# EAGLE schematic RoPi 2560 (EAGLE 6.5.0)
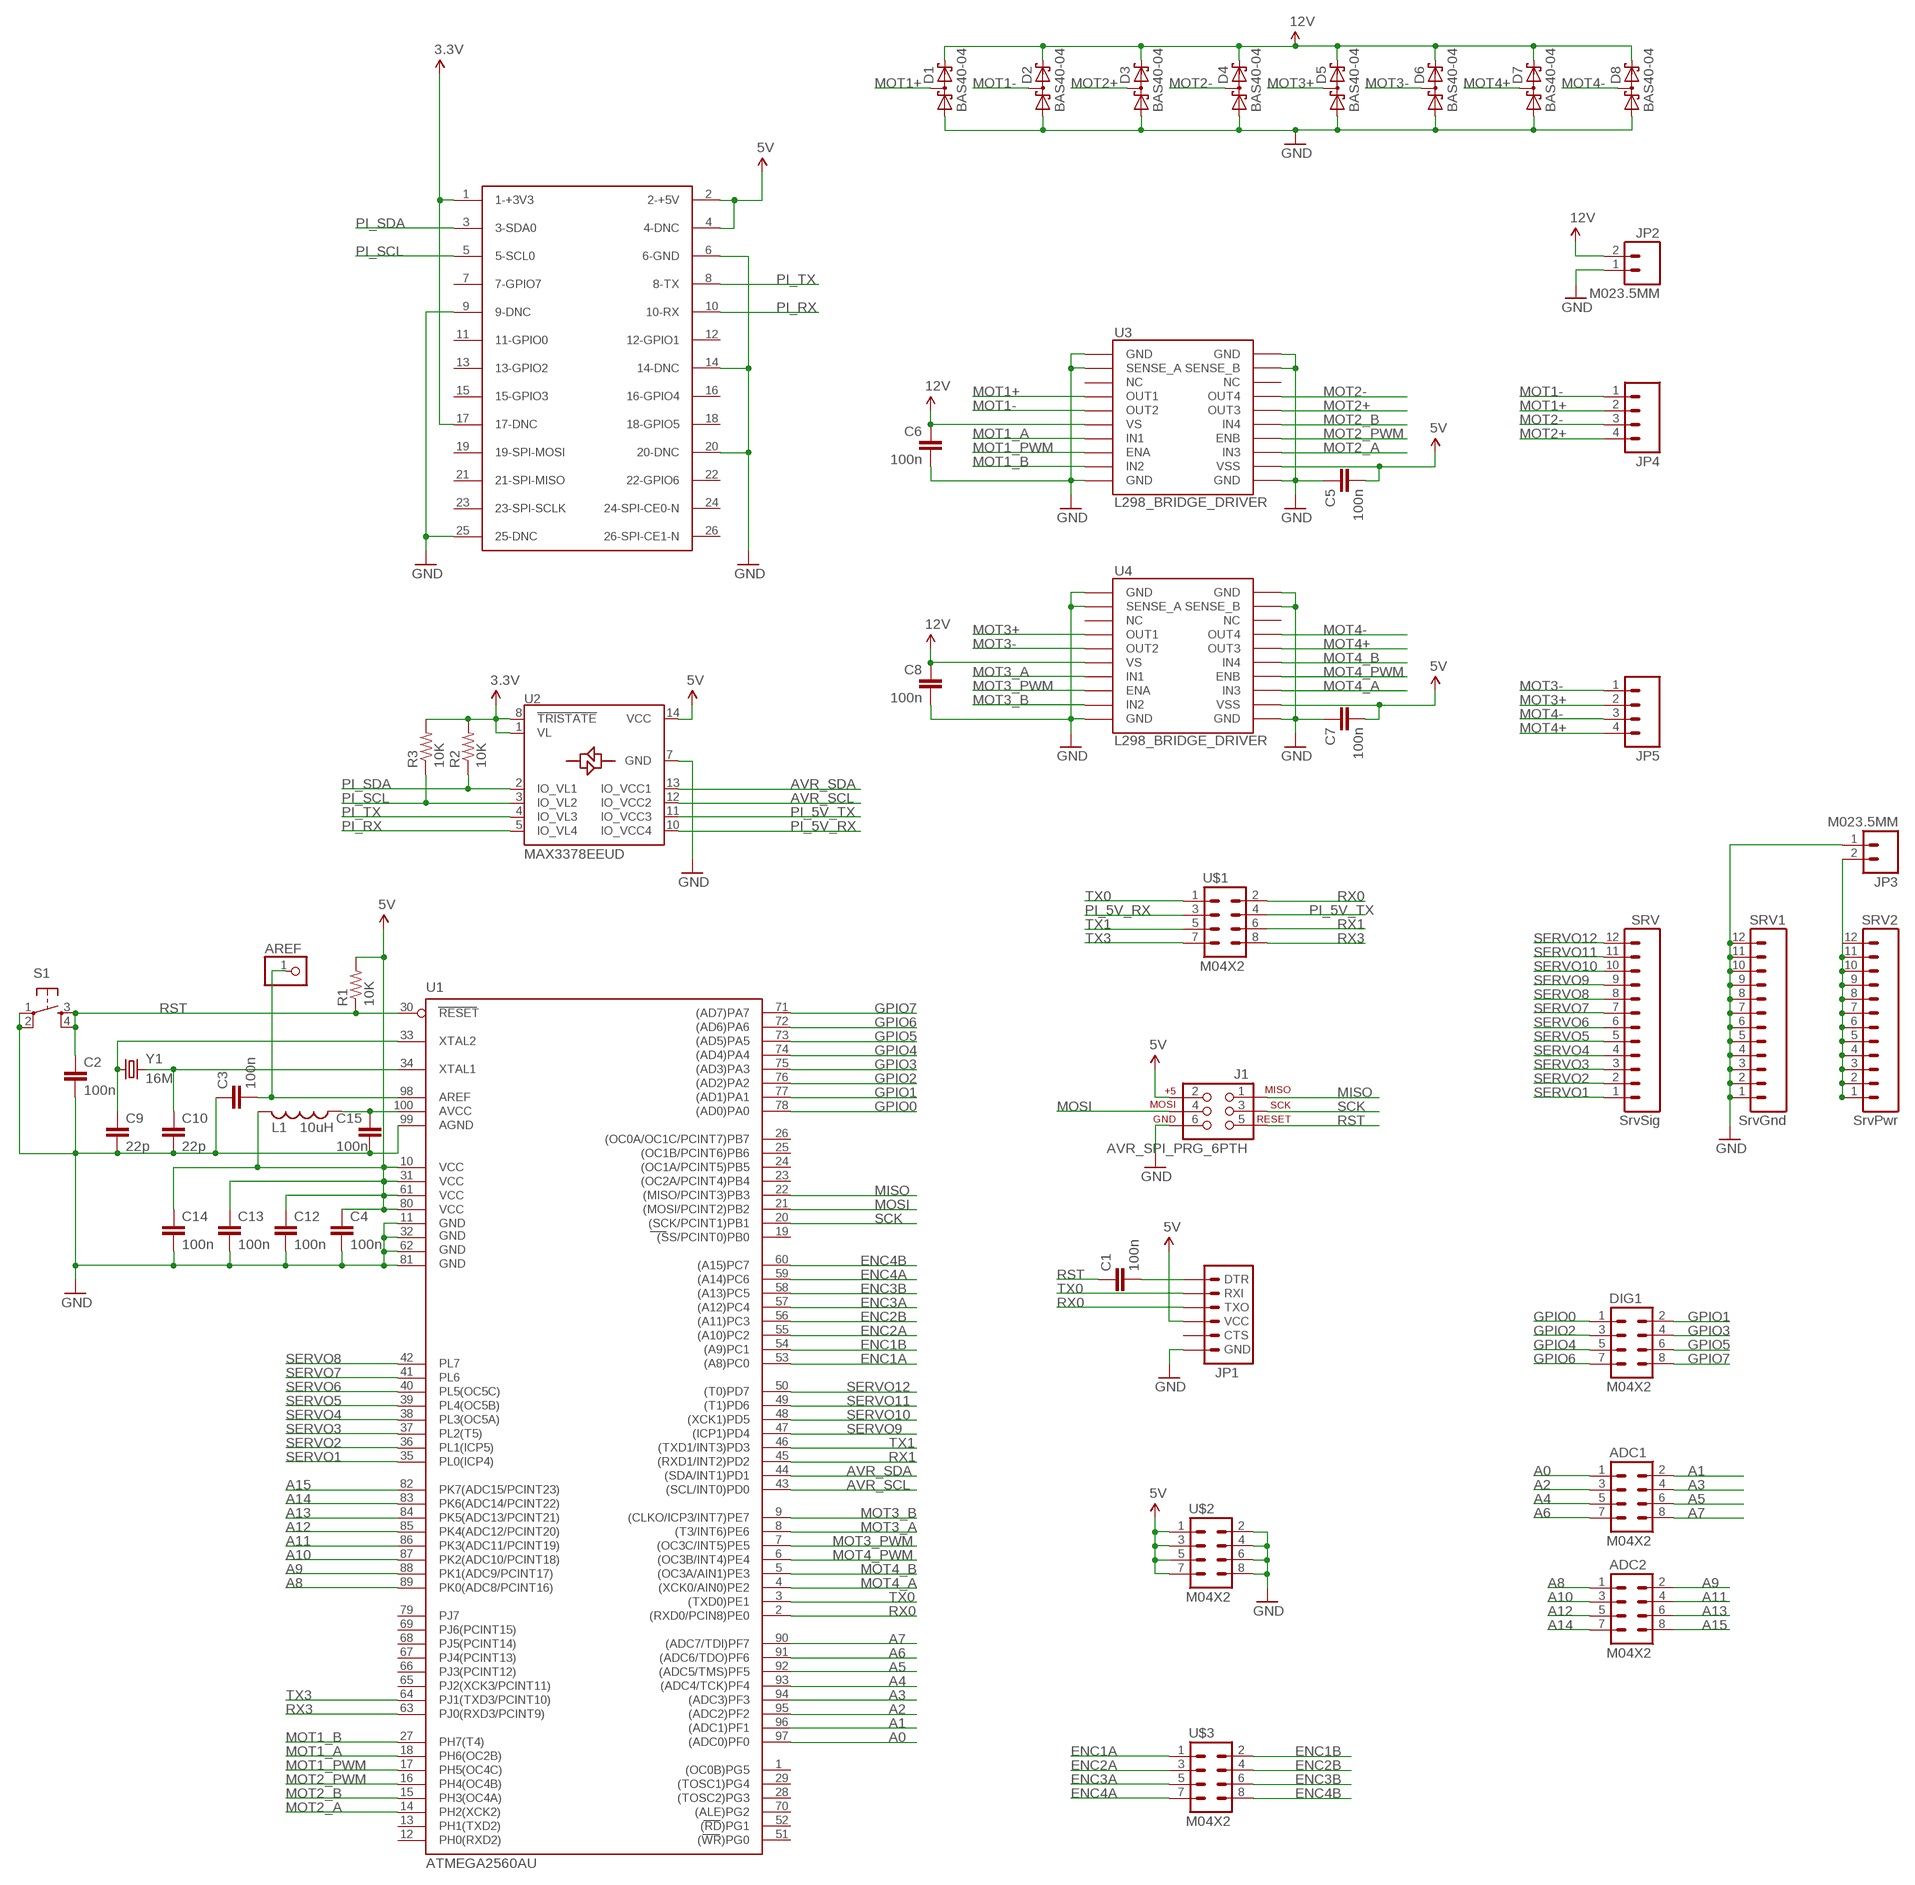
[diagram p0: schematic, sheet 1]

## Parts
ADC1  M04X2  [2X4]
ADC2  M04X2  [2X4]
AREF  PINHD-1X1  [1X01]
C1  100n  CAP0603-CAP  [0603-CAP]
C2  100n  CAP0603-CAP  [0603-CAP]
C3  100n  CAP0603-CAP  [0603-CAP]
C4  100n  CAP0603-CAP  [0603-CAP]
C5  100n  CAP0603-CAP  [0603-CAP]
C6  100n  CAP0603-CAP  [0603-CAP]
C7  100n  CAP0603-CAP  [0603-CAP]
C8  100n  CAP0603-CAP  [0603-CAP]
C9  22p  CAP0603-CAP  [0603-CAP]
C10  22p  CAP0603-CAP  [0603-CAP]
C12  100n  CAP0603-CAP  [0603-CAP]
C13  100n  CAP0603-CAP  [0603-CAP]
C14  100n  CAP0603-CAP  [0603-CAP]
C15  100n  CAP0603-CAP  [0603-CAP]
D1  BAS40-04  [SOT23]
D2  BAS40-04  [SOT23]
D3  BAS40-04  [SOT23]
D4  BAS40-04  [SOT23]
D5  BAS40-04  [SOT23]
D6  BAS40-04  [SOT23]
D7  BAS40-04  [SOT23]
D8  BAS40-04  [SOT23]
DIG1  M04X2  [2X4]
J1  AVR_SPI_PRG_6PTH  [2X3]
JP1  ARDUINO_SERIAL_PROGRAMSMD  [1X06-SMD]
JP2  M023.5MM  [SCREWTERMINAL-3.5MM-2]
JP3  M023.5MM  [SCREWTERMINAL-3.5MM-2]
JP4  M04SCREW  [SCREWTERMINAL-3.5MM-4]
JP5  M04SCREW  [SCREWTERMINAL-3.5MM-4]
L1  10uH  L-US  [R0603]
PI  RASPBERRY-PI  [RASPBERRY-PI]
R1  10K  RESISTOR0603-RES  [0603-RES]
R2  10K  RESISTOR0603-RES  [0603-RES]
R3  10K  RESISTOR0603-RES  [0603-RES]
S1  TAC_SWITCHSMD  [TACTILE_SWITCH_SMD]
SRV  SrvSig  M12PTH  [1X12]
SRV1  SrvGnd  M12PTH  [1X12]
SRV2  SrvPwr  M12PTH  [1X12]
U1  ATMEGA2560AU  [TQFP100]
U2  MAX3378EEUD  [TSSOP14]
U3  L298_BRIDGE_DRIVER  [POWERSO20]
U4  L298_BRIDGE_DRIVER  [POWERSO20]
U$1  M04X2  [2X4]
U$2  M04X2  [2X4]
U$3  M04X2  [2X4]
Y1  16M  CRYSTALSMD  [HC49UP]

## Nets
3.3V: PI.1(1-+3V3) PI.17(17-DNC) R2.2 R3.2 U2.1(VL) U2.8(!TRISTATE)
5V: C4.1 C5.2 C7.2 C12.1 C13.1 C14.1 J1.2 JP1.4(VCC) L1.2 PI.2(2-+5V) PI.4(4-DNC) R1.2 U1.10(VCC) U1.31(VCC1) U1.61(VCC2) U1.80(VCC3) U2.14(VCC) U3.12(VSS) U4.12(VSS) U$2.1 U$2.3 U$2.5 U$2.7
A0: ADC1.1 U1.97((ADC0)PF0)
A1: ADC1.2 U1.96((ADC1)PF1)
A2: ADC1.3 U1.95((ADC2)PF2)
A3: ADC1.4 U1.94((ADC3)PF3)
A4: ADC1.5 U1.93((ADC4/TCK)PF4)
A5: ADC1.6 U1.92((ADC5/TMS)PF5)
A6: ADC1.7 U1.91((ADC6/TDO)PF6)
A7: ADC1.8 U1.90((ADC7/TDI)PF7)
A8: ADC2.1 U1.89(PK0(ADC8/PCINT16))
A9: ADC2.2 U1.88(PK1(ADC9/PCINT17))
A10: ADC2.3 U1.87(PK2(ADC10/PCINT18))
A11: ADC2.4 U1.86(PK3(ADC11/PCINT19))
A12: ADC2.5 U1.85(PK4(ADC12/PCINT20))
A13: ADC2.6 U1.84(PK5(ADC13/PCINT21))
A14: ADC2.7 U1.83(PK6(ADC14/PCINT22))
A15: ADC2.8 U1.82(PK7(ADC15/PCINT23))
AREF: AREF.1 C3.2 U1.98(AREF)
AVR_SCL: U1.43((SCL/INT0)PD0) U2.12(IO_VCC2)
AVR_SDA: U1.44((SDA/INT1)PD1) U2.13(IO_VCC1)
DTR: C1.2 JP1.1(DTR)
ENC1A: U1.53((A8)PC0) U$3.1
ENC1B: U1.54((A9)PC1) U$3.2
ENC2A: U1.55((A10)PC2) U$3.3
ENC2B: U1.56((A11)PC3) U$3.4
ENC3A: U1.57((A12)PC4) U$3.5
ENC3B: U1.58((A13)PC5) U$3.6
ENC4A: U1.59((A14)PC6) U$3.7
ENC4B: U1.60((A15)PC7) U$3.8
GND: C2.2 C3.1 C4.2 C5.1 C6.2 C7.1 C8.2 C9.2 C10.2 C12.2 C13.2 C14.2 C15.2 D1.1(A1) D2.1(A1) D3.1(A1) D4.1(A1) D5.1(A1) D6.1(A1) D7.1(A1) D8.1(A1) J1.6 JP1.6(GND) JP2.1 JP3.1 PI.6(6-GND) PI.9(9-DNC) PI.14(14-DNC) PI.20(20-DNC) PI.25(25-DNC) S1.1 S1.2 SRV1.1 SRV1.2 SRV1.3 SRV1.4 SRV1.5 SRV1.6 SRV1.7 SRV1.8 SRV1.9 SRV1.10 SRV1.11 SRV1.12 U1.11(GND) U1.32(GND1) U1.62(GND2) U1.81(GND3) U1.99(AGND) U2.7(GND) U3.1(GND) U3.2(SENSE_A) U3.10(GND) U3.11(GND) U3.19(SENSE_B) U3.20(GND) U4.1(GND) U4.2(SENSE_A) U4.10(GND) U4.11(GND) U4.19(SENSE_B) U4.20(GND) U$2.2 U$2.4 U$2.6 U$2.8
GPIO0: DIG1.1 U1.78((AD0)PA0)
GPIO1: DIG1.2 U1.77((AD1)PA1)
GPIO2: DIG1.3 U1.76((AD2)PA2)
GPIO3: DIG1.4 U1.75((AD3)PA3)
GPIO4: DIG1.5 U1.74((AD4)PA4)
GPIO5: DIG1.6 U1.73((AD5)PA5)
GPIO6: DIG1.7 U1.72((AD6)PA6)
GPIO7: DIG1.8 U1.71((AD7)PA7)
MISO: J1.1 U1.22((MISO/PCINT3)PB3)
MOSI: J1.4 U1.21((MOSI/PCINT2)PB2)
MOT1+: D1.3(C1A2) JP4.2 U3.4(OUT1)
MOT1-: D2.3(C1A2) JP4.1 U3.5(OUT2)
MOT1_A: U1.18(PH6(OC2B)) U3.7(IN1)
MOT1_B: U1.27(PH7(T4)) U3.9(IN2)
MOT1_PWM: U1.17(PH5(OC4C)) U3.8(ENA)
MOT2+: D3.3(C1A2) JP4.4 U3.16(OUT3)
MOT2-: D4.3(C1A2) JP4.3 U3.17(OUT4)
MOT2_A: U1.14(PH2(XCK2)) U3.13(IN3)
MOT2_B: U1.15(PH3(OC4A)) U3.15(IN4)
MOT2_PWM: U1.16(PH4(OC4B)) U3.14(ENB)
MOT3+: D5.3(C1A2) JP5.2 U4.4(OUT1)
MOT3-: D6.3(C1A2) JP5.1 U4.5(OUT2)
MOT3_A: U1.8((T3/INT6)PE6) U4.7(IN1)
MOT3_B: U1.9((CLKO/ICP3/INT7)PE7) U4.9(IN2)
MOT3_PWM: U1.7((OC3C/INT5)PE5) U4.8(ENA)
MOT4+: D7.3(C1A2) JP5.4 U4.16(OUT3)
MOT4-: D8.3(C1A2) JP5.3 U4.17(OUT4)
MOT4_A: U1.4((XCK0/AIN0)PE2) U4.13(IN3)
MOT4_B: U1.5((OC3A/AIN1)PE3) U4.15(IN4)
MOT4_PWM: U1.6((OC3B/INT4)PE4) U4.14(ENB)
N$1: JP3.2 SRV2.1 SRV2.2 SRV2.3 SRV2.4 SRV2.5 SRV2.6 SRV2.7 SRV2.8 SRV2.9 SRV2.10 SRV2.11 SRV2.12
N$2: C15.1 L1.1 U1.100(AVCC)
PI_5V_RX: U2.10(IO_VCC4) U$1.3
PI_5V_TX: U2.11(IO_VCC3) U$1.4
PI_RX: PI.10(10-RX) U2.5(IO_VL4)
PI_SCL: PI.5(5-SCL0) R3.1 U2.3(IO_VL2)
PI_SDA: PI.3(3-SDA0) R2.1 U2.2(IO_VL1)
PI_TX: PI.8(8-TX) U2.4(IO_VL3)
RST: C1.1 C2.1 J1.5 R1.1 S1.3 S1.4 U1.30(RESET)
RX0: JP1.3(TXO) U1.2((RXD0/PCIN8)PE0) U$1.2
RX1: U1.45((RXD1/INT2)PD2) U$1.6
RX3: U1.63(PJ0(RXD3/PCINT9)) U$1.8
SCK: J1.3 U1.20((SCK/PCINT1)PB1)
SERVO1: SRV.1 U1.35(PL0(ICP4))
SERVO2: SRV.2 U1.36(PL1(ICP5))
SERVO3: SRV.3 U1.37(PL2(T5))
SERVO4: SRV.4 U1.38(PL3(OC5A))
SERVO5: SRV.5 U1.39(PL4(OC5B))
SERVO6: SRV.6 U1.40(PL5(OC5C))
SERVO7: SRV.7 U1.41(PL6)
SERVO8: SRV.8 U1.42(PL7)
SERVO9: SRV.9 U1.47((ICP1)PD4)
SERVO10: SRV.10 U1.48((XCK1)PD5)
SERVO11: SRV.11 U1.49((T1)PD6)
SERVO12: SRV.12 U1.50((T0)PD7)
TX0: JP1.2(RXI) U1.3((TXD0)PE1) U$1.1
TX1: U1.46((TXD1/INT3)PD3) U$1.5
TX3: U1.64(PJ1(TXD3/PCINT10)) U$1.7
V_BATT: C6.1 C8.1 D1.2(C2) D2.2(C2) D3.2(C2) D4.2(C2) D5.2(C2) D6.2(C2) D7.2(C2) D8.2(C2) JP2.2 U3.6(VS) U4.6(VS) ; supply symbol labelled 12V
XTAL1: C10.1 U1.34(XTAL1) Y1.2
XTAL2: C9.1 U1.33(XTAL2) Y1.1
Unconnected: JP1.5(CTS) PI.7(7-GPIO7) PI.11(11-GPIO0) PI.12(12-GPIO1) PI.13(13-GPIO2) PI.15(15-GPIO3) PI.16(16-GPIO4) PI.18(18-GPIO5) PI.19(19-SPI-MOSI) PI.21(21-SPI-MISO) PI.22(22-GPIO6) PI.23(23-SPI-SCLK) PI.24(24-SPI-CE0-N) PI.26(26-SPI-CE1-N) U1.1((OC0B)PG5) U1.12(PH0(RXD2)) U1.13(PH1(TXD2)) U1.19((SS/PCINT0)PB0) U1.23((OC2A/PCINT4)PB4) U1.24((OC1A/PCINT5)PB5) U1.25((OC1B/PCINT6)PB6) U1.26((OC0A/OC1C/PCINT7)PB7) U1.28((TOSC2)PG3) U1.29((TOSC1)PG4) U1.51((WR)PG0) U1.52((RD)PG1) U1.65(PJ2(XCK3/PCINT11)) U1.66(PJ3(PCINT12)) U1.67(PJ4(PCINT13)) U1.68(PJ5(PCINT14)) U1.69(PJ6(PCINT15)) U1.70((ALE)PG2) U1.79(PJ7) U3.3(NC) U3.18(NC) U4.3(NC) U4.18(NC)

## Library data of the parts
ADC1 ADC2 DIG1 U$1-U$3 = SparkFun-Connectors:M04X2: .1" header, two rows of four.
AREF = pinhead:PINHD-1X1: PIN HEADER
C1-C10 C12-C15 = SparkFun-Passives:CAP: Capacitor Standard 0603 ceramic capacitor, and 0.1" leaded capacitor.
D1-D8 = diode:BAS40-04: Silicon Schottky Diodes General-purpose diode for high-speed switching
J1 = SparkFun-Connectors:AVR_SPI_PRG_6: AVR ISP 6 Pin This is the reduced ISP connector for AVR programming. Common on Arduino. This footprint will take up less PCB space and can be used with a 10-pin to 6-pin adapter such as SKU: BOB-08508
JP1 = SparkFun-Connectors:ARDUINO_SERIAL_PROGRAM: FTDI connector footprints
JP2 JP3 = SparkFun-Connectors:M02: Standard 2-pin 0.1" header. Use with - straight break away headers ( PRT-00116) - right angle break away headers (PRT-00553) - swiss pins (PRT-00743) - machine pins (PRT-00117) - female headers (PRT-00115) Molex polarized connector foot print use with: PRT-08233 with associated crimp pins and housings. 2.54_SCREWTERM for use with PRT-10571. 3.5mm Screw Terminal footprints for PRT-08084 5mm Screw Terminal footprints for use with PRT-08433
JP4 JP5 = SparkFun-Connectors:M04: Header 4 Standard 4-pin 0.1" header. Use with straight break away headers (SKU : PRT-00116), right angle break away headers (PRT-00553), swiss pins (PRT-00743), machine pins (PRT-00117), and female headers (PRT-00115). Molex polarized connector foot print use with SKU : PRT-08231 with associated crimp pins and housings. 1MM SMD Version SKU: PRT-10208
L1 = dab5267:L-US: INDUCTOR, American symbol
PI = RaspberryPi:RASPBERRY-PI: Raspberry Pi Board <http://www.raspberrypi.org/> Jacques Lagnel V1.0 (beta) 2012 Board dimension: Forum 3D model <http://www.raspberrypi.org/forum/general-discussion/mechanical-profile-3d-models?value=3d%20model&type=1&include=1&search=1&ret=all> The GPIO Connector (P1): http://elinux.org/RPi_Low-level_peripherals
R1-R3 = SparkFun-Passives:RESISTOR: Resistor Basic schematic elements and footprints for 0603, 1206, and PTH resistors.
S1 = SparkFun-Electromechanical:TAC_SWITCH: Momentary Switch Button commonly used for reset or general input. Spark Fun Electronics SKU : COM-00097 SMT- SWCH-08247; PROD_ID: SWCH-08247
SRV SRV1 SRV2 = SparkFun-Connectors:M12: Header 12 Standard 12-pin 0.1" header. Use with straight break away headers (SKU : PRT-00116), right angle break away headers (PRT-00553), swiss pins (PRT-00743), machine pins (PRT-00117), and female headers (PRT-00115).
U1 = SparkFun-DigitalIC:ATMEGA2560: Atmel 100-pin 8-bit uC 64/128/256 Kbytes FLASH 4 Kbytes EEPROM 8 Kbytes SRAM 86 General Purpose I/O pins 12-channels16-bit PWM 4 x Serial USARTs 16-channels 10-bit A/D
U2 = max3378e:MAX3378EEUD: ±15kV ESD-Protected, 1µA, 16Mbps, Dual/Quad Low-Voltage Level Translators in UCSP
U3 U4 = SparkFun-PowerIC:L298_BRIDGE_DRIVER: Full-bridge power driver IC
Y1 = SparkFun-FreqCtrl:CRYSTAL: Various standard crystals. Proven footprints. Spark Fun Electronics SKU : COM-00534